# Altium schematic sheet Marvin_global.SchDoc
size A
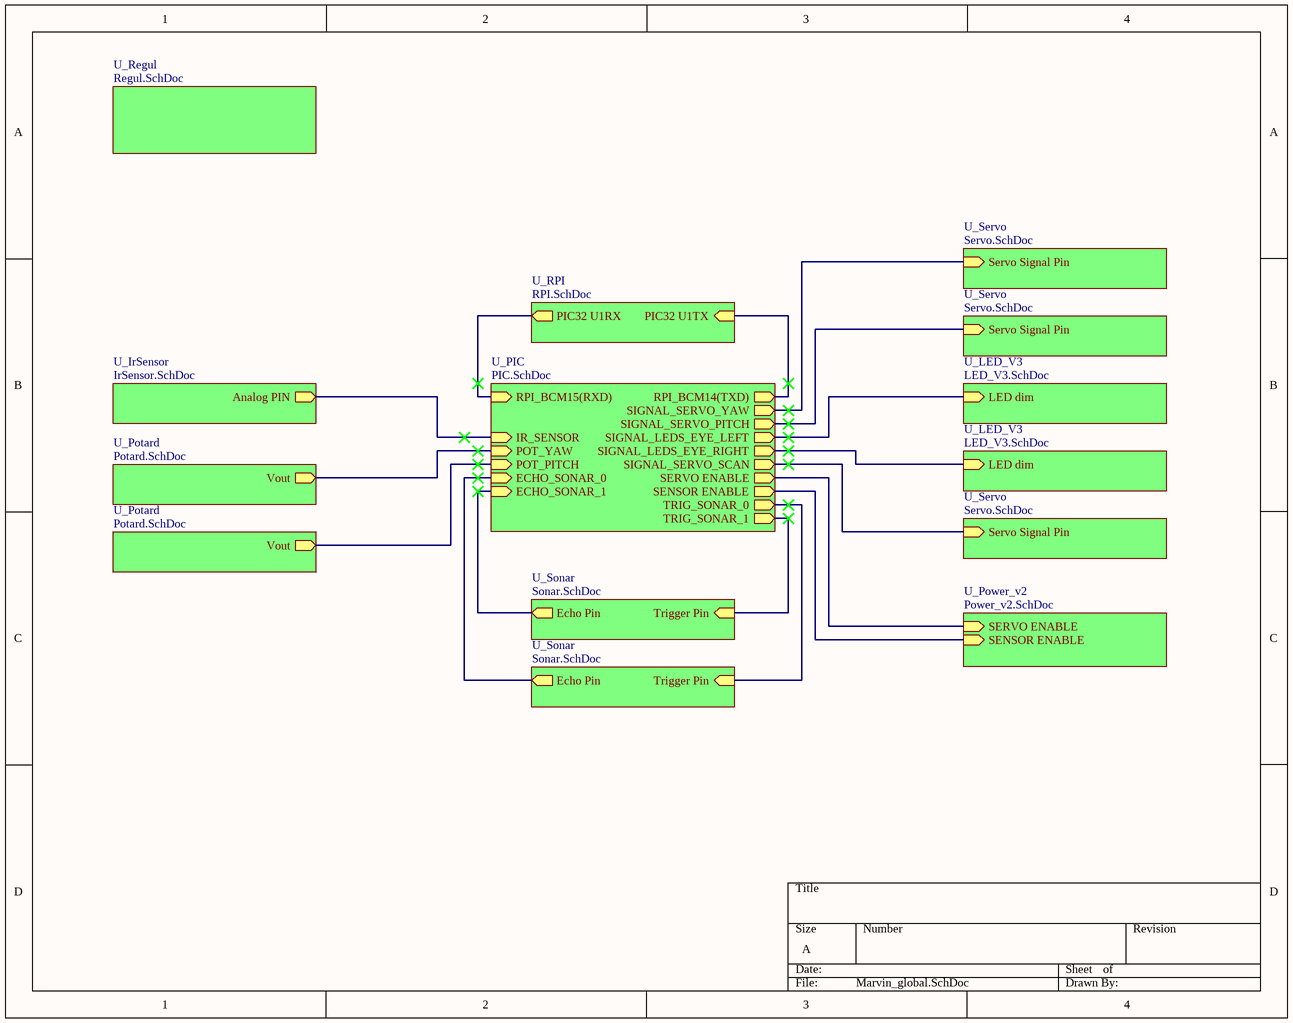
[diagram p0: Marvin_global.SchDoc]

## Sub-sheets
U_IrSensor = IrSensor.SchDoc: Analog PIN (out)
U_LED_V3 = LED_V3.SchDoc: LED dim (in)
U_LED_V3 = LED_V3.SchDoc: LED dim (in)
U_PIC = PIC.SchDoc: RPI_BCM15(RXD) (in), RPI_BCM14(TXD) (out), SIGNAL_SERVO_YAW (out), SIGNAL_SERVO_PITCH (out), SIGNAL_LEDS_EYE_LEFT (out), SIGNAL_LEDS_EYE_RIGHT (out), SIGNAL_SERVO_SCAN (out), TRIG_SONAR_0 (out), TRIG_SONAR_1 (out), ECHO_SONAR_0 (in), ECHO_SONAR_1 (in), IR_SENSOR (in), POT_YAW (in), POT_PITCH (in), SERVO ENABLE (out), SENSOR ENABLE (out)
U_Potard = Potard.SchDoc: Vout (out)
U_Potard = Potard.SchDoc: Vout (out)
U_Power_v2 = Power_v2.SchDoc: SERVO ENABLE (in), SENSOR ENABLE (in)
U_Regul = Regul.SchDoc: no entries
U_RPI = RPI.SchDoc: PIC32 U1TX (in), PIC32 U1RX (out)
U_Servo = Servo.SchDoc: Servo Signal Pin (in)
U_Servo = Servo.SchDoc: Servo Signal Pin (in)
U_Servo = Servo.SchDoc: Servo Signal Pin (in)
U_Sonar = Sonar.SchDoc: Trigger Pin (in), Echo Pin (out)
U_Sonar = Sonar.SchDoc: Trigger Pin (in), Echo Pin (out)

## Nets
(unnamed): sheet U_IrSensor/Analog PIN, sheet U_PIC/IR_SENSOR
(unnamed): sheet U_LED_V3/LED dim, sheet U_PIC/SIGNAL_LEDS_EYE_LEFT
(unnamed): sheet U_LED_V3/LED dim, sheet U_PIC/SIGNAL_LEDS_EYE_RIGHT
(unnamed): sheet U_Potard/Vout, sheet U_PIC/POT_YAW
(unnamed): sheet U_Potard/Vout, sheet U_PIC/POT_PITCH
(unnamed): sheet U_Power_v2/SERVO ENABLE, sheet U_PIC/SERVO ENABLE
(unnamed): sheet U_Power_v2/SENSOR ENABLE, sheet U_PIC/SENSOR ENABLE
(unnamed): sheet U_RPI/PIC32 U1TX, sheet U_PIC/RPI_BCM14(TXD)
(unnamed): sheet U_RPI/PIC32 U1RX, sheet U_PIC/RPI_BCM15(RXD)
(unnamed): sheet U_Servo/Servo Signal Pin, sheet U_PIC/SIGNAL_SERVO_YAW
(unnamed): sheet U_Sonar/Trigger Pin, sheet U_PIC/TRIG_SONAR_0
(unnamed): sheet U_Sonar/Echo Pin, sheet U_PIC/ECHO_SONAR_0
(unnamed): sheet U_Servo/Servo Signal Pin, sheet U_PIC/SIGNAL_SERVO_PITCH
(unnamed): sheet U_Servo/Servo Signal Pin, sheet U_PIC/SIGNAL_SERVO_SCAN
(unnamed): sheet U_Sonar/Trigger Pin, sheet U_PIC/TRIG_SONAR_1
(unnamed): sheet U_Sonar/Echo Pin, sheet U_PIC/ECHO_SONAR_1